# Altium schematic sheet TLevelMeterWindow.SchDoc: LiveDesign Evaluation - Countdown
size A4; Organization: Altium Limited; Address1: L3, 12a Rodborough Rd; Address2: Frenchs Forest; Address3: NSW; Address4: Australia 2086; DocumentNumber: 10; SheetNumber: 10; SheetTotal: 11
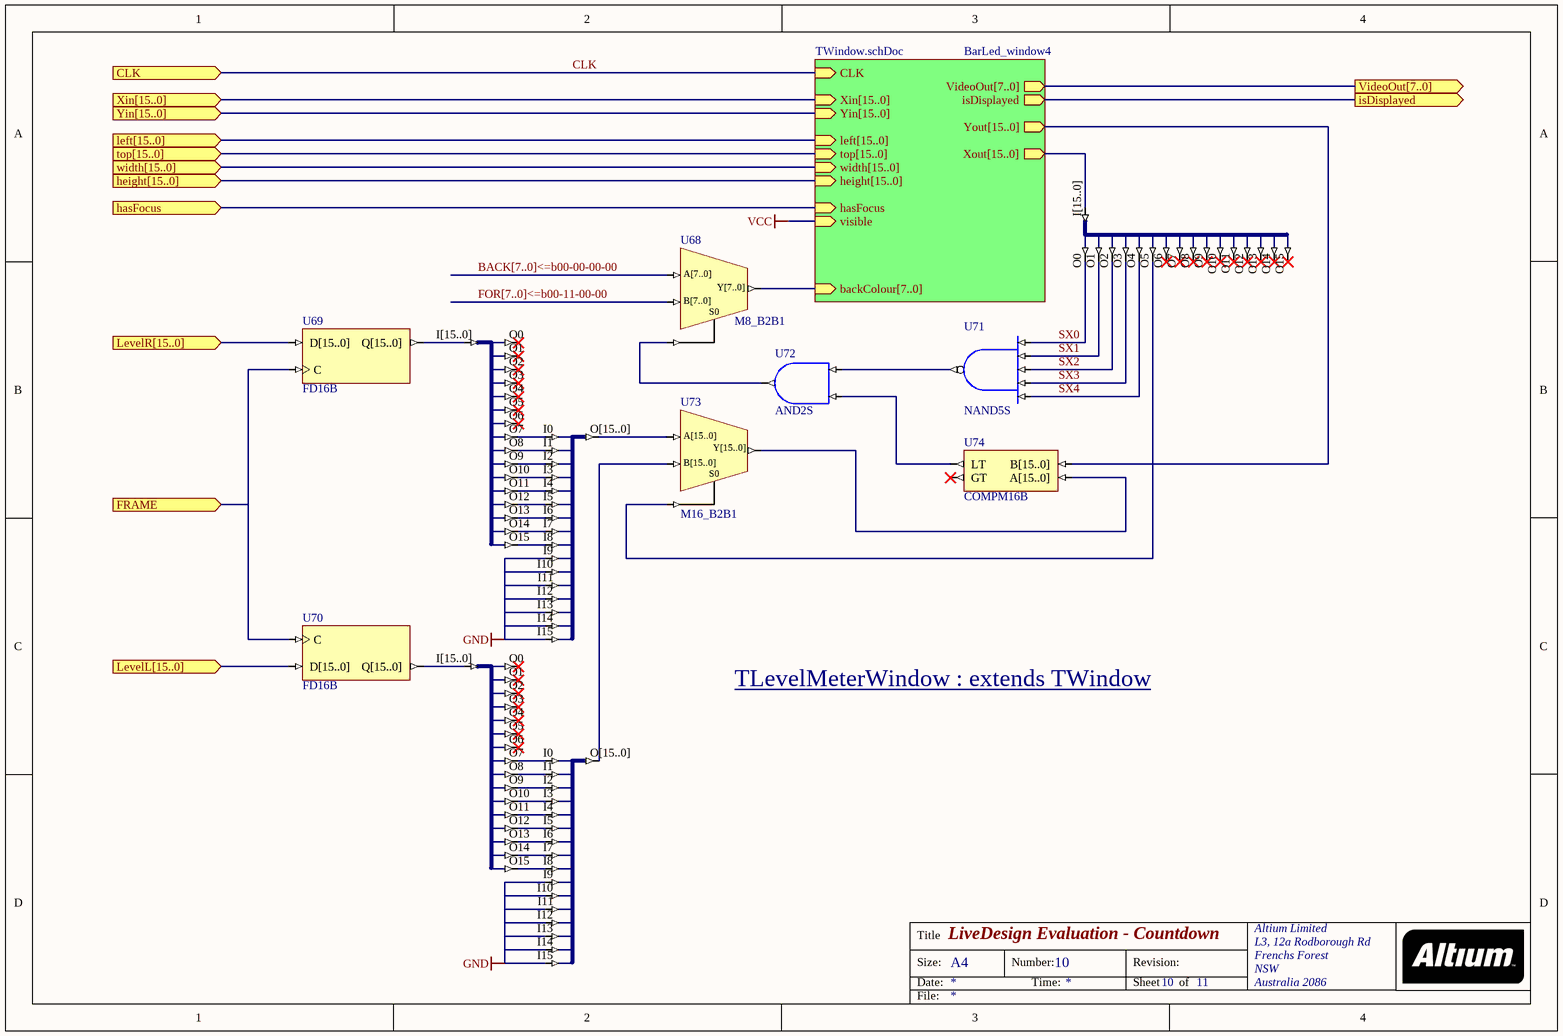
[diagram p0: TLevelMeterWindow.SchDoc]

## Parts
U63  J16B_16S  (value not drawn)
U64  J16B_16S  (value not drawn)
U65  J16B_16S  (value not drawn)
U66  J16S_16B  (value not drawn)
U67  J16S_16B  (value not drawn)
U68  M8_B2B1
U69  FD16B
U70  FD16B
U71  NAND5S
U72  AND2S
U73  M16_B2B1
U74  COMPM16B

## Sub-sheets
BarLed_window4 = TWindow.schDoc: CLK (in), VideoOut[7..0] (out), Xin[15..0] (in), Yin[15..0] (in), top[15..0] (in), width[15..0] (in), height[15..0] (in), left[15..0] (in), Xout[15..0] (out), Yout[15..0] (out), backColour[7..0] (in), isDisplayed (out), visible (in), hasFocus (in)

## Ports
CLK (in), FRAME (in), hasFocus (in), height[15..0] (in), isDisplayed (out), left[15..0] (in), LevelL[15..0] (in), LevelR[15..0] (in), top[15..0] (in), VideoOut[7..0] (out), width[15..0] (in), Xin[15..0] (in), Yin[15..0] (in)

## Nets
GND: U66.I9 U66.I10 U66.I11 U66.I12 U66.I13 U66.I14 U66.I15 U67.I9 U67.I10 U67.I11 U67.I12 U67.I13 U67.I14 U67.I15
VCC: sheet BarLed_window4/visible
BACK[7..0]<=b00-00-00-00: U68.A[7..0]
CLK: port CLK, sheet BarLed_window4/CLK
FOR[7..0]<=b00-11-00-00: U68.B[7..0]
FRAME: U69.C U70.C ; port FRAME
hasFocus: port hasFocus, sheet BarLed_window4/hasFocus
isDisplayed: port isDisplayed, sheet BarLed_window4/isDisplayed
LevelL[15..0]: U70.D[15..0] ; port LevelL[15..0]
LevelR[15..0]: U69.D[15..0] ; port LevelR[15..0]
SX0: U63.O0 U71.I4
SX1: U63.O1 U71.I3
SX2: U63.O2 U71.I2
SX3: U63.O3 U71.I1
SX4: U63.O4 U71.I0
NetU63_I[15..0]: U63.I[15..0] ; sheet BarLed_window4/Xout[15..0]
NetU63_O5: U63.O5 U73.S0
NetU64_I[15..0]: U64.I[15..0] U69.Q[15..0]
NetU64_O7: U64.O7 U66.I0
NetU64_O8: U64.O8 U66.I1
NetU64_O9: U64.O9 U66.I2
NetU64_O10: U64.O10 U66.I3
NetU64_O11: U64.O11 U66.I4
NetU64_O12: U64.O12 U66.I5
NetU64_O13: U64.O13 U66.I6
NetU64_O14: U64.O14 U66.I7
NetU64_O15: U64.O15 U66.I8
NetU65_I[15..0]: U65.I[15..0] U70.Q[15..0]
NetU65_O7: U65.O7 U67.I0
NetU65_O8: U65.O8 U67.I1
NetU65_O9: U65.O9 U67.I2
NetU65_O10: U65.O10 U67.I3
NetU65_O11: U65.O11 U67.I4
NetU65_O12: U65.O12 U67.I5
NetU65_O13: U65.O13 U67.I6
NetU65_O14: U65.O14 U67.I7
NetU65_O15: U65.O15 U67.I8
NetU66_O[15..0]: U66.O[15..0] U73.A[15..0]
NetU67_O[15..0]: U67.O[15..0] U73.B[15..0]
NetU68_S0: U68.S0 U72.O
NetU68_Y[7..0]: U68.Y[7..0] ; sheet BarLed_window4/backColour[7..0]
NetU71_O: U71.O U72.I1
NetU72_I0: U72.I0 U74.LT
NetU73_Y[15..0]: U73.Y[15..0] U74.A[15..0]
NetU74_B[15..0]: U74.B[15..0] ; sheet BarLed_window4/Yout[15..0]

Not connected (* = marked no-connect by the designer): U63 O6* O7* O8* O9* O10* O11* O12* O13* O14* O15*; U64 O0* O1* O2* O3* O4* O5* O6*; U65 O0* O1* O2* O3* O4* O5* O6*; U74 GT*

## Buses and harness runs
bus BACK[7..0]<=b00-00-00-00
bus FOR[7..0]<=b00-11-00-00
bus port height[15..0] = sheet BarLed_window4/height[15..0]
bus port left[15..0] = sheet BarLed_window4/left[15..0]
bus port top[15..0] = sheet BarLed_window4/top[15..0]
bus port VideoOut[7..0] = sheet BarLed_window4/VideoOut[7..0]
bus port width[15..0] = sheet BarLed_window4/width[15..0]
bus port Xin[15..0] = sheet BarLed_window4/Xin[15..0]
bus port Yin[15..0] = sheet BarLed_window4/Yin[15..0]

## Notes on the sheet
- TLevelMeterWindow : extends TWindow
- Title
- Size:
- Date:
- A4
- Number:
- Time:
- Revision:
- Sheet
- of
- File:

## Library data of the parts
U63-U65 = J16B_16S: Single 16-Bit input bus to 16 single pin outputs; ArchiveName: GENERIC; VHDLIB_SIM: GENERIC_LIB; Published: 29-Jan-2004; Publisher: Altium Limited; Core Revision: 1.00.00
U66 U67 = J16S_16B: 16 Single pin inputs to single 16-Bit output bus; ArchiveName: GENERIC; VHDLIB_SIM: GENERIC_LIB; Published: 29-Jan-2004; Publisher: Altium Limited; Core Revision: 1.00.00
U68 = M8_B2B1: 2x8-Bit Bus to 1x8-Bit Bus Multiplexer; ArchiveName: GENERIC; VHDLIB_SIM: GENERIC_LIB; Published: 29-Jan-2004; Publisher: Altium Limited; Core Revision: 1.00.00
U69 U70 = FD16B: 16-Bit D-Type Flip-Flop, Bus Version; ArchiveName: GENERIC; VHDLIB_SIM: GENERIC_LIB; Published: 29-Jan-2004; Publisher: Altium Limited; Core Revision: 1.00.00
U71 = NAND5S: 5-Input NAND Gate, Single Pin Version; ArchiveName: GENERIC; VHDLIB_SIM: GENERIC_LIB; Xilinx Equivalent: NAND5; Published: 29-Jan-2004; Publisher: Altium Limited; Core Revision: 1.00.00
U72 = AND2S: 2-Input AND Gate, Single Pin Version; ArchiveName: GENERIC; VHDLIB_SIM: GENERIC_LIB; Xilinx Equivalent: AND2; Published: 29-Jan-2004; Publisher: Altium Limited; Core Revision: 1.00.00
U73 = M16_B2B1: 2x16-Bit Bus to 1x16-Bit Bus Multiplexer; ArchiveName: GENERIC; VHDLIB_SIM: GENERIC_LIB; Published: 29-Jan-2004; Publisher: Altium Limited; Core Revision: 1.00.00
U74 = COMPM16B: 16-Bit Magnitude Comparator, Bus Version; ArchiveName: GENERIC; VHDLIB_SIM: GENERIC_LIB; Published: 29-Jan-2004; Publisher: Altium Limited; Xilinx Equivalent: COMPM16; Core Revision: 1.00.00